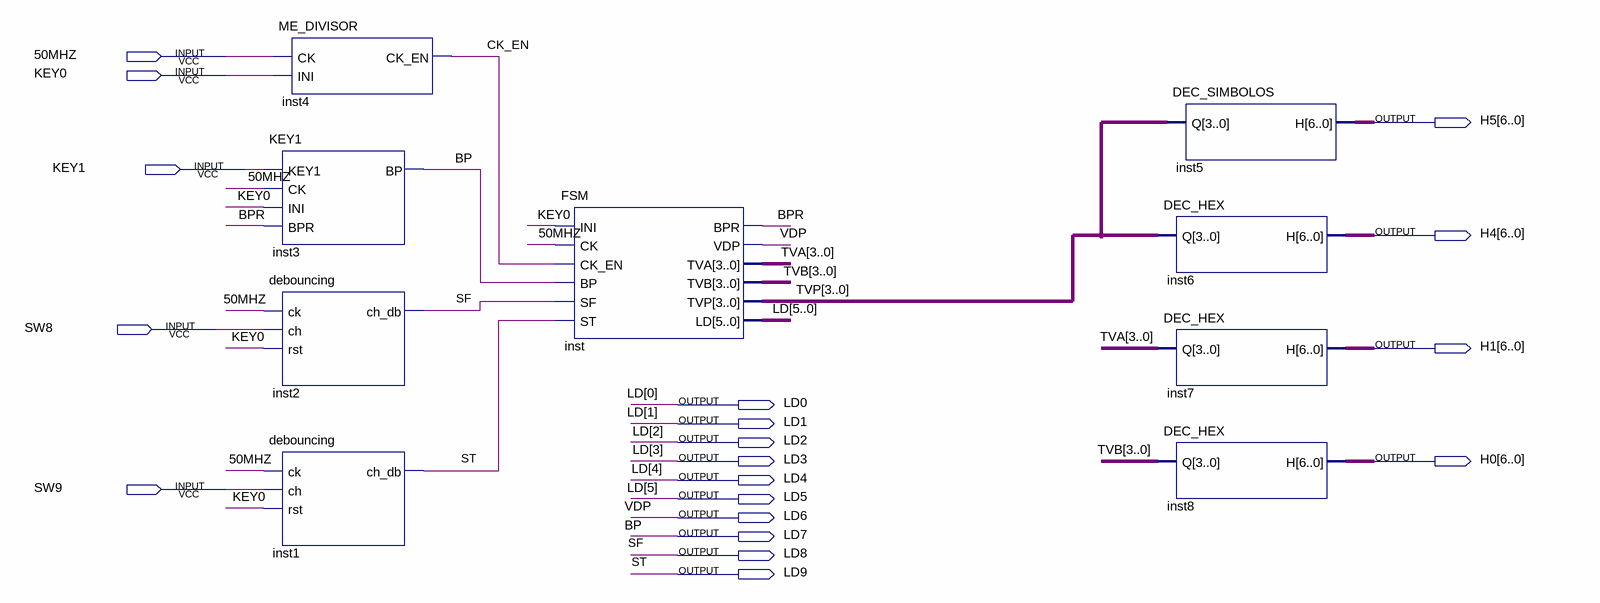
[diagram p0: schematic sheet]
// Quartus schematic key.bdf as structural Verilog: 9 symbols, 19 pins
module key (
  input  \50MHZ ,
  input  KEY0,
  input  KEY1,
  input  SW8,
  input  SW9,
  output [6:0] H5,
  output [6:0] H4,
  output [6:0] H1,
  output LD0,
  output LD1,
  output LD2,
  output LD3,
  output [6:0] H0,
  output LD4,
  output LD5,
  output LD6,
  output LD7,
  output LD8,
  output LD9
);

  wire BPR, CK_EN;
  wire [3:0] TVA, TVB, TVP;

  ME_DIVISOR inst4 (.CK(\50MHZ ), .INI(KEY0), .CK_EN(CK_EN));
  KEY1 inst3 (.KEY1(KEY1), .CK(\50MHZ ), .INI(KEY0), .BPR(BPR), .BP(LD7));
  debouncing inst2 (.ck(\50MHZ ), .ch(SW8), .rst(KEY0), .ch_db(LD8));
  debouncing inst1 (.ck(\50MHZ ), .ch(SW9), .rst(KEY0), .ch_db(LD9));
  FSM inst (
    .INI(KEY0), .CK(\50MHZ ), .CK_EN(CK_EN), .BP(LD7), .SF(LD8), .ST(LD9), .BPR(BPR), .VDP(LD6), .TVA(TVA),
    .TVB(TVB), .TVP(TVP), .LD({LD5, LD4, LD3, LD2, LD1, LD0}));
  DEC_SIMBOLOS inst5 (.Q(TVP), .H(H5));
  DEC_HEX inst6 (.Q(TVP), .H(H4));
  DEC_HEX inst7 (.Q(TVA), .H(H1));
  DEC_HEX inst8 (.Q(TVB), .H(H0));

  // Other names for the same wires on the sheet: BP = LD7; SF = LD8; ST = LD9; VDP = LD6
endmodule
